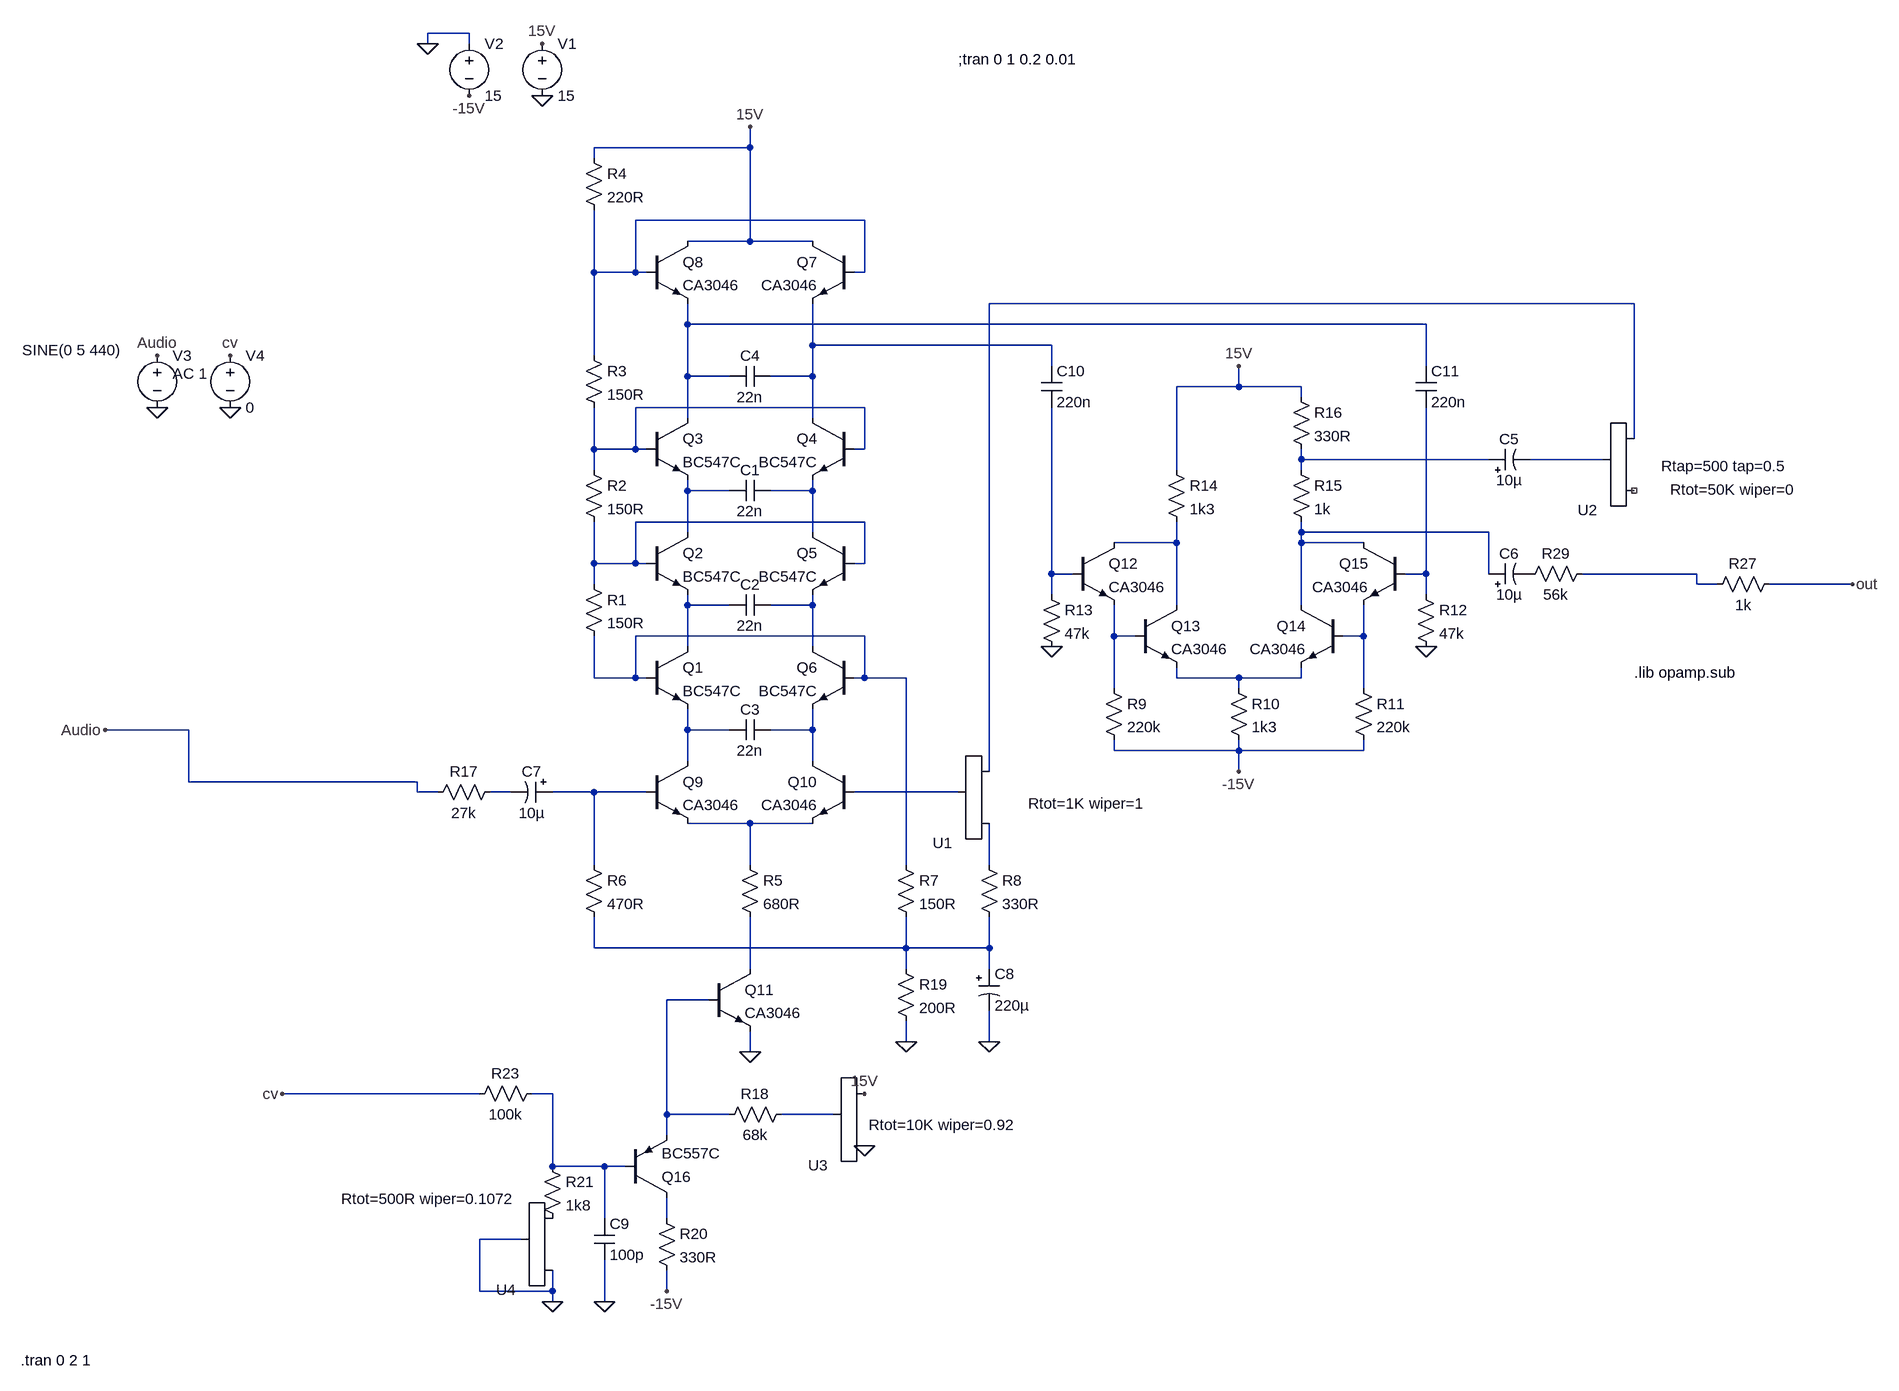
[diagram p0: schematic Moog filter - schmitzbits - constant current.asc]
Moog filter - schmitzbits - constant current.asc, the LTspice schematic file:
Version 4
SHEET 1 2220 1228
WIRE -240 -832 -304 -832
WIRE -304 -816 -304 -832
WIRE -240 -816 -240 -832
WIRE 192 -656 192 -688
WIRE 192 -656 -48 -656
WIRE -48 -640 -48 -656
WIRE 368 -544 16 -544
WIRE 192 -512 192 -656
WIRE 192 -512 96 -512
WIRE 288 -512 192 -512
WIRE -48 -464 -48 -560
WIRE 16 -464 16 -544
WIRE 16 -464 -48 -464
WIRE 32 -464 16 -464
WIRE 368 -464 368 -544
WIRE 368 -464 352 -464
WIRE 1552 -416 560 -416
WIRE 96 -384 96 -416
WIRE 1232 -384 96 -384
WIRE 288 -352 288 -416
WIRE 656 -352 288 -352
WIRE -48 -336 -48 -464
WIRE 656 -320 656 -352
WIRE 1232 -320 1232 -384
WIRE 96 -304 96 -384
WIRE 160 -304 96 -304
WIRE 288 -304 288 -352
WIRE 288 -304 224 -304
WIRE 944 -288 944 -320
WIRE 944 -288 848 -288
WIRE 1040 -288 944 -288
WIRE 1040 -272 1040 -288
WIRE 368 -256 16 -256
WIRE 96 -240 96 -304
WIRE 288 -240 288 -304
WIRE 1552 -208 1552 -416
WIRE -48 -192 -48 -256
WIRE 16 -192 16 -256
WIRE 16 -192 -48 -192
WIRE 32 -192 16 -192
WIRE 368 -192 368 -256
WIRE 368 -192 352 -192
WIRE 1040 -176 1040 -192
WIRE 1328 -176 1040 -176
WIRE 1504 -176 1392 -176
WIRE -48 -160 -48 -192
WIRE 848 -160 848 -288
WIRE 1040 -160 1040 -176
WIRE 96 -128 96 -144
WIRE 160 -128 96 -128
WIRE 288 -128 288 -144
WIRE 288 -128 224 -128
WIRE 368 -80 16 -80
WIRE 96 -64 96 -128
WIRE 288 -64 288 -128
WIRE 1040 -64 1040 -80
WIRE 1328 -64 1040 -64
WIRE 848 -48 848 -80
WIRE 848 -48 752 -48
WIRE 1040 -48 1040 -64
WIRE 1136 -48 1040 -48
WIRE -48 -16 -48 -80
WIRE 16 -16 16 -80
WIRE 16 -16 -48 -16
WIRE 32 -16 16 -16
WIRE 368 -16 368 -80
WIRE 368 -16 352 -16
WIRE 656 0 656 -256
WIRE 688 0 656 0
WIRE 1232 0 1232 -256
WIRE 1232 0 1200 0
WIRE 1328 0 1328 -64
WIRE 1648 0 1472 0
WIRE -48 16 -48 -16
WIRE 1648 16 1648 0
WIRE 1680 16 1648 16
WIRE 1888 16 1760 16
WIRE 656 32 656 0
WIRE 1232 32 1232 0
WIRE 96 48 96 32
WIRE 160 48 96 48
WIRE 288 48 288 32
WIRE 288 48 224 48
WIRE 848 48 848 -48
WIRE 1040 48 1040 -48
WIRE 368 96 16 96
WIRE 752 96 752 48
WIRE 784 96 752 96
WIRE 1136 96 1136 48
WIRE 1136 96 1104 96
WIRE 96 112 96 48
WIRE 288 112 288 48
WIRE -48 160 -48 96
WIRE 16 160 16 96
WIRE 16 160 -48 160
WIRE 32 160 16 160
WIRE 368 160 368 96
WIRE 368 160 352 160
WIRE 432 160 368 160
WIRE 848 160 848 144
WIRE 944 160 848 160
WIRE 1040 160 1040 144
WIRE 1040 160 944 160
WIRE 752 176 752 96
WIRE 944 176 944 160
WIRE 1136 176 1136 96
WIRE -672 240 -800 240
WIRE 96 240 96 208
WIRE 160 240 96 240
WIRE 288 240 288 208
WIRE 288 240 224 240
WIRE 752 272 752 256
WIRE 944 272 944 256
WIRE 944 272 752 272
WIRE 1136 272 1136 256
WIRE 1136 272 944 272
WIRE 96 288 96 240
WIRE 288 288 288 240
WIRE 560 304 560 -416
WIRE 944 304 944 272
WIRE -672 320 -672 240
WIRE -320 320 -672 320
WIRE -320 336 -320 320
WIRE -288 336 -320 336
WIRE -176 336 -208 336
WIRE -48 336 -112 336
WIRE 32 336 -48 336
WIRE 512 336 352 336
WIRE 192 384 96 384
WIRE 288 384 192 384
WIRE -48 448 -48 336
WIRE 192 448 192 384
WIRE 432 448 432 160
WIRE 560 448 560 384
WIRE -48 576 -48 528
WIRE 432 576 432 528
WIRE 432 576 -48 576
WIRE 560 576 560 528
WIRE 560 576 432 576
WIRE 192 608 192 528
WIRE 432 608 432 576
WIRE 560 608 560 576
WIRE 128 656 64 656
WIRE 432 720 432 688
WIRE 560 720 560 672
WIRE 192 736 192 704
WIRE -224 800 -528 800
WIRE -112 800 -144 800
WIRE 64 832 64 656
WIRE 160 832 64 832
WIRE 320 832 240 832
WIRE 64 864 64 832
WIRE -112 912 -112 800
WIRE -32 912 -112 912
WIRE 0 912 -32 912
WIRE -32 992 -32 912
WIRE 64 992 64 960
WIRE -160 1024 -224 1024
WIRE -224 1104 -224 1024
WIRE -112 1104 -112 1072
WIRE -112 1104 -224 1104
WIRE 64 1104 64 1072
WIRE -112 1120 -112 1104
WIRE -32 1120 -32 1056
FLAG 192 -688 15V
FLAG -128 -816 15V
FLAG -128 -736 0
FLAG 944 304 -15V
FLAG 656 112 0
FLAG 1232 112 0
FLAG -304 -816 0
FLAG -240 -736 -15V
FLAG 944 -320 15V
FLAG 192 736 0
FLAG 368 880 0
FLAG 368 800 15V
FLAG 432 720 0
FLAG 560 720 0
FLAG 64 1104 -15V
FLAG -112 1120 0
FLAG -32 1120 0
FLAG -528 800 cv
FLAG -800 240 Audio
FLAG 1888 16 out
FLAG -608 -256 0
FLAG -720 -256 0
FLAG -720 -336 Audio
FLAG -608 -336 cv
SYMBOL npn 32 112 R0
SYMATTR InstName Q1
SYMATTR Value BC547C
SYMBOL npn 32 -64 R0
SYMATTR InstName Q2
SYMATTR Value BC547C
SYMBOL npn 32 -240 R0
SYMATTR InstName Q3
SYMATTR Value BC547C
SYMBOL npn 352 -240 M0
SYMATTR InstName Q4
SYMATTR Value BC547C
SYMBOL npn 352 -64 M0
SYMATTR InstName Q5
SYMATTR Value BC547C
SYMBOL npn 352 112 M0
SYMATTR InstName Q6
SYMATTR Value BC547C
SYMBOL cap 224 -144 R90
WINDOW 0 0 32 VBottom 2
WINDOW 3 32 32 VTop 2
SYMATTR InstName C1
SYMATTR Value 22n
SYMBOL cap 224 32 R90
WINDOW 0 0 32 VBottom 2
WINDOW 3 32 32 VTop 2
SYMATTR InstName C2
SYMATTR Value 22n
SYMBOL cap 224 224 R90
WINDOW 0 0 32 VBottom 2
WINDOW 3 32 32 VTop 2
SYMATTR InstName C3
SYMATTR Value 22n
SYMBOL cap 224 -320 R90
WINDOW 0 0 32 VBottom 2
WINDOW 3 32 32 VTop 2
SYMATTR InstName C4
SYMATTR Value 22n
SYMBOL npn 352 -512 M0
SYMATTR InstName Q7
SYMATTR Value CA3046
SYMBOL npn 32 -512 R0
SYMATTR InstName Q8
SYMATTR Value CA3046
SYMBOL voltage -128 -832 R0
WINDOW 123 0 0 Left 2
WINDOW 39 0 0 Left 2
SYMATTR InstName V1
SYMATTR Value 15
SYMBOL res -64 0 R0
SYMATTR InstName R1
SYMATTR Value 150R
SYMBOL res -64 -176 R0
SYMATTR InstName R2
SYMATTR Value 150R
SYMBOL res -64 -352 R0
SYMATTR InstName R3
SYMATTR Value 150R
SYMBOL res -64 -656 R0
SYMATTR InstName R4
SYMATTR Value 220R
SYMBOL npn 32 288 R0
SYMATTR InstName Q9
SYMATTR Value CA3046
SYMBOL npn 352 288 M0
SYMATTR InstName Q10
SYMATTR Value CA3046
SYMBOL npn 128 608 R0
SYMATTR InstName Q11
SYMATTR Value CA3046
SYMBOL res 176 432 R0
SYMATTR InstName R5
SYMATTR Value 680R
SYMBOL res -64 432 R0
SYMATTR InstName R6
SYMATTR Value 470R
SYMBOL res 416 432 R0
SYMATTR InstName R7
SYMATTR Value 150R
SYMBOL res 544 432 R0
SYMATTR InstName R8
SYMATTR Value 330R
SYMBOL npn 688 -48 R0
SYMATTR InstName Q12
SYMATTR Value CA3046
SYMBOL npn 784 48 R0
SYMATTR InstName Q13
SYMATTR Value CA3046
SYMBOL npn 1104 48 M0
SYMATTR InstName Q14
SYMATTR Value CA3046
SYMBOL npn 1200 -48 M0
SYMATTR InstName Q15
SYMATTR Value CA3046
SYMBOL res 736 160 R0
SYMATTR InstName R9
SYMATTR Value 220k
SYMBOL res 928 160 R0
SYMATTR InstName R10
SYMATTR Value 1k3
SYMBOL res 1120 160 R0
SYMATTR InstName R11
SYMATTR Value 220k
SYMBOL res 1216 16 R0
SYMATTR InstName R12
SYMATTR Value 47k
SYMBOL res 640 16 R0
SYMATTR InstName R13
SYMATTR Value 47k
SYMBOL voltage -240 -832 R0
WINDOW 123 0 0 Left 2
WINDOW 39 0 0 Left 2
SYMATTR InstName V2
SYMATTR Value 15
SYMBOL res 832 -176 R0
SYMATTR InstName R14
SYMATTR Value 1k3
SYMBOL res 1024 -176 R0
SYMATTR InstName R15
SYMATTR Value 1k
SYMBOL res 1024 -288 R0
SYMATTR InstName R16
SYMATTR Value 330R
SYMBOL Misc\\potentiometer_standard 576 400 R180
WINDOW 3 -224 47 Left 2
WINDOW 39 -201 84 Left 2
SYMATTR InstName U1
SYMATTR Value Rtot=1K wiper=1
SYMATTR SpiceLine ""
SYMBOL Misc\\potentiometer_standard 1568 -112 R180
WINDOW 3 -233 18 Left 2
WINDOW 39 -220 54 Left 2
SYMATTR InstName U2
SYMATTR Value Rtot=50K wiper=0
SYMATTR SpiceLine Rtap=500 tap=0.5
SYMATTR SpiceModel pot_nlog
SYMBOL polcap 1328 -160 R270
WINDOW 0 32 32 VTop 2
WINDOW 3 0 32 VBottom 2
SYMATTR InstName C5
SYMATTR Value 10µ
SYMATTR Description Capacitor
SYMATTR Type cap
SYMATTR SpiceLine V=63 Irms=200m Rser=1.3 Lser=0
SYMBOL polcap 1328 16 R270
WINDOW 0 32 32 VTop 2
WINDOW 3 0 32 VBottom 2
SYMATTR InstName C6
SYMATTR Value 10µ
SYMATTR Description Capacitor
SYMATTR Type cap
SYMATTR SpiceLine V=63 Irms=200m Rser=1.3 Lser=0
SYMBOL polcap -112 320 R90
WINDOW 0 0 32 VBottom 2
WINDOW 3 32 32 VTop 2
SYMATTR InstName C7
SYMATTR Value 10µ
SYMATTR Description Capacitor
SYMATTR Type cap
SYMATTR SpiceLine V=63 Irms=200m Rser=1.3 Lser=0
SYMBOL res -304 352 R270
WINDOW 0 32 56 VTop 2
WINDOW 3 0 56 VBottom 2
SYMATTR InstName R17
SYMATTR Value 27k
SYMBOL res 256 816 R90
WINDOW 0 0 56 VBottom 2
WINDOW 3 32 56 VTop 2
SYMATTR InstName R18
SYMATTR Value 68k
SYMBOL pnp 0 960 M180
SYMATTR InstName Q16
SYMATTR Value BC557C
SYMBOL Misc\\potentiometer_standard 384 896 R180
WINDOW 3 -218 48 Left 2
WINDOW 39 -193 78 Left 2
SYMATTR InstName U3
SYMATTR Value Rtot=10K wiper=0.92
SYMATTR SpiceLine ""
SYMBOL res 416 592 R0
SYMATTR InstName R19
SYMATTR Value 200R
SYMBOL polcap 544 608 R0
SYMATTR InstName C8
SYMATTR Value 220µ
SYMATTR Description Capacitor
SYMATTR Type cap
SYMATTR SpiceLine V=63 Irms=200m Rser=1.3 Lser=0
SYMBOL res 48 976 R0
SYMATTR InstName R20
SYMATTR Value 330R
SYMBOL cap -48 992 R0
SYMATTR InstName C9
SYMATTR Value 100p
SYMBOL res -128 896 R0
SYMATTR InstName R21
SYMATTR Value 1k8
SYMBOL Misc\\potentiometer_standard -96 1088 R180
SYMATTR InstName U4
SYMATTR Value Rtot=500R wiper=0.1072
SYMATTR SpiceLine ""
SYMBOL res -128 784 R90
WINDOW 0 0 56 VBottom 2
WINDOW 3 32 56 VTop 2
SYMATTR InstName R23
SYMATTR Value 100k
SYMBOL res 1664 32 R270
WINDOW 0 32 56 VTop 2
WINDOW 3 0 56 VBottom 2
SYMATTR InstName R27
SYMATTR Value 1k
SYMBOL res 1488 -16 R90
WINDOW 0 0 56 VBottom 2
WINDOW 3 32 56 VTop 2
SYMATTR InstName R29
SYMATTR Value 56k
SYMBOL voltage -720 -352 R0
WINDOW 123 24 44 Left 2
WINDOW 39 0 0 Left 2
WINDOW 3 -208 8 Left 2
SYMATTR Value2 AC 1
SYMATTR InstName V3
SYMATTR Value SINE(0 5 440)
SYMBOL voltage -608 -352 R0
WINDOW 123 0 0 Left 2
WINDOW 39 0 0 Left 2
SYMATTR InstName V4
SYMATTR Value 0
SYMBOL cap 640 -320 R0
SYMATTR InstName C10
SYMATTR Value 220n
SYMBOL cap 1216 -320 R0
SYMATTR InstName C11
SYMATTR Value 220n
TEXT 512 -792 Left 2 !;tran 0 1 0.2 0.01
TEXT 1552 152 Left 2 !.lib opamp.sub
TEXT -930 1210 Left 2 !.tran 0 2 1

The netlist it stands for:
* Moog filter - schmitzbits - constant current.asc
Q1 N016 N018 N022 0 BC547C
Q2 N008 N010 N016 0 BC547C
Q3 N003 N005 N008 0 BC547C
Q4 N004 N005 N009 0 BC547C
Q5 N009 N010 N017 0 BC547C
Q6 N017 N018 N023 0 BC547C
C1 N009 N008 22n
C2 N017 N016 22n
C3 N023 N022 22n
C4 N004 N003 22n
Q7 15V N001 N004 0 CA3046
Q8 15V N001 N003 0 CA3046
V1 15V 0 15
R1 N010 N018 150R
R2 N005 N010 150R
R3 N001 N005 150R
R4 15V N001 220R
Q9 N022 N025 N027 0 CA3046
Q10 N023 N026 N027 0 CA3046
Q11 N030 N031 0 0 CA3046
R5 N027 N030 680R
R6 N025 N029 470R
R7 N018 N029 150R
R8 N028 N029 330R
Q12 N012 N013 N019 0 CA3046
Q13 N012 N019 N021 0 CA3046
Q14 N011 N020 N021 0 CA3046
Q15 N011 N014 N020 0 CA3046
R9 N019 -15V 220k
R10 N021 -15V 1k3
R11 N020 -15V 220k
R12 N014 0 47k
R13 N013 0 47k
V2 0 -15V 15
R14 15V N012 1k3
R15 N006 N011 1k
R16 15V N006 330R
XU1 N028 N002 N026 Rtot=1K wiper=1
XU2 NC_01 N002 N007 pot_nlog Rtot=50K wiper=0 Rtap=500 tap=0.5
C5 N006 N007 10µ V=63 Irms=200m Rser=1.3 Lser=0
C6 N011 P001 10µ V=63 Irms=200m Rser=1.3 Lser=0
C7 N025 N024 10µ V=63 Irms=200m Rser=1.3 Lser=0
R17 Audio N024 27k
R18 N033 N031 68k
Q16 N034 N032 N031 0 BC557C
XU3 0 15V N033 Rtot=10K wiper=0.92
R19 N029 0 200R
C8 N029 0 220µ V=63 Irms=200m Rser=1.3 Lser=0
R20 N034 -15V 330R
C9 N032 0 100p
R21 N032 P002 1k8
XU4 0 P002 0 Rtot=500R wiper=0.1072
R23 N032 cv 100k
R27 N015 out 1k
R29 N015 P001 56k
V3 Audio 0 SINE(0 5 440) AC 1
V4 cv 0 0
C10 N004 N013 220n
C11 N003 N014 220n
.model NPN NPN
.model PNP PNP
.lib standard.bjt
;tran 0 1 0.2 0.01
.lib opamp.sub
.tran 0 2 1
.backanno
.end